# EasyEDA Pro project aixiaozhi.eprj

# Schematic Schematic1
Board Name: Board1; Create Date: 2025-05-02; Page Name: P1; Project Name: aixiaozhi; Schematic Name: Schematic1; Update Date: 2025-05-04; Company: 嘉立创EDA; Page Size: A4; Version: V1.0
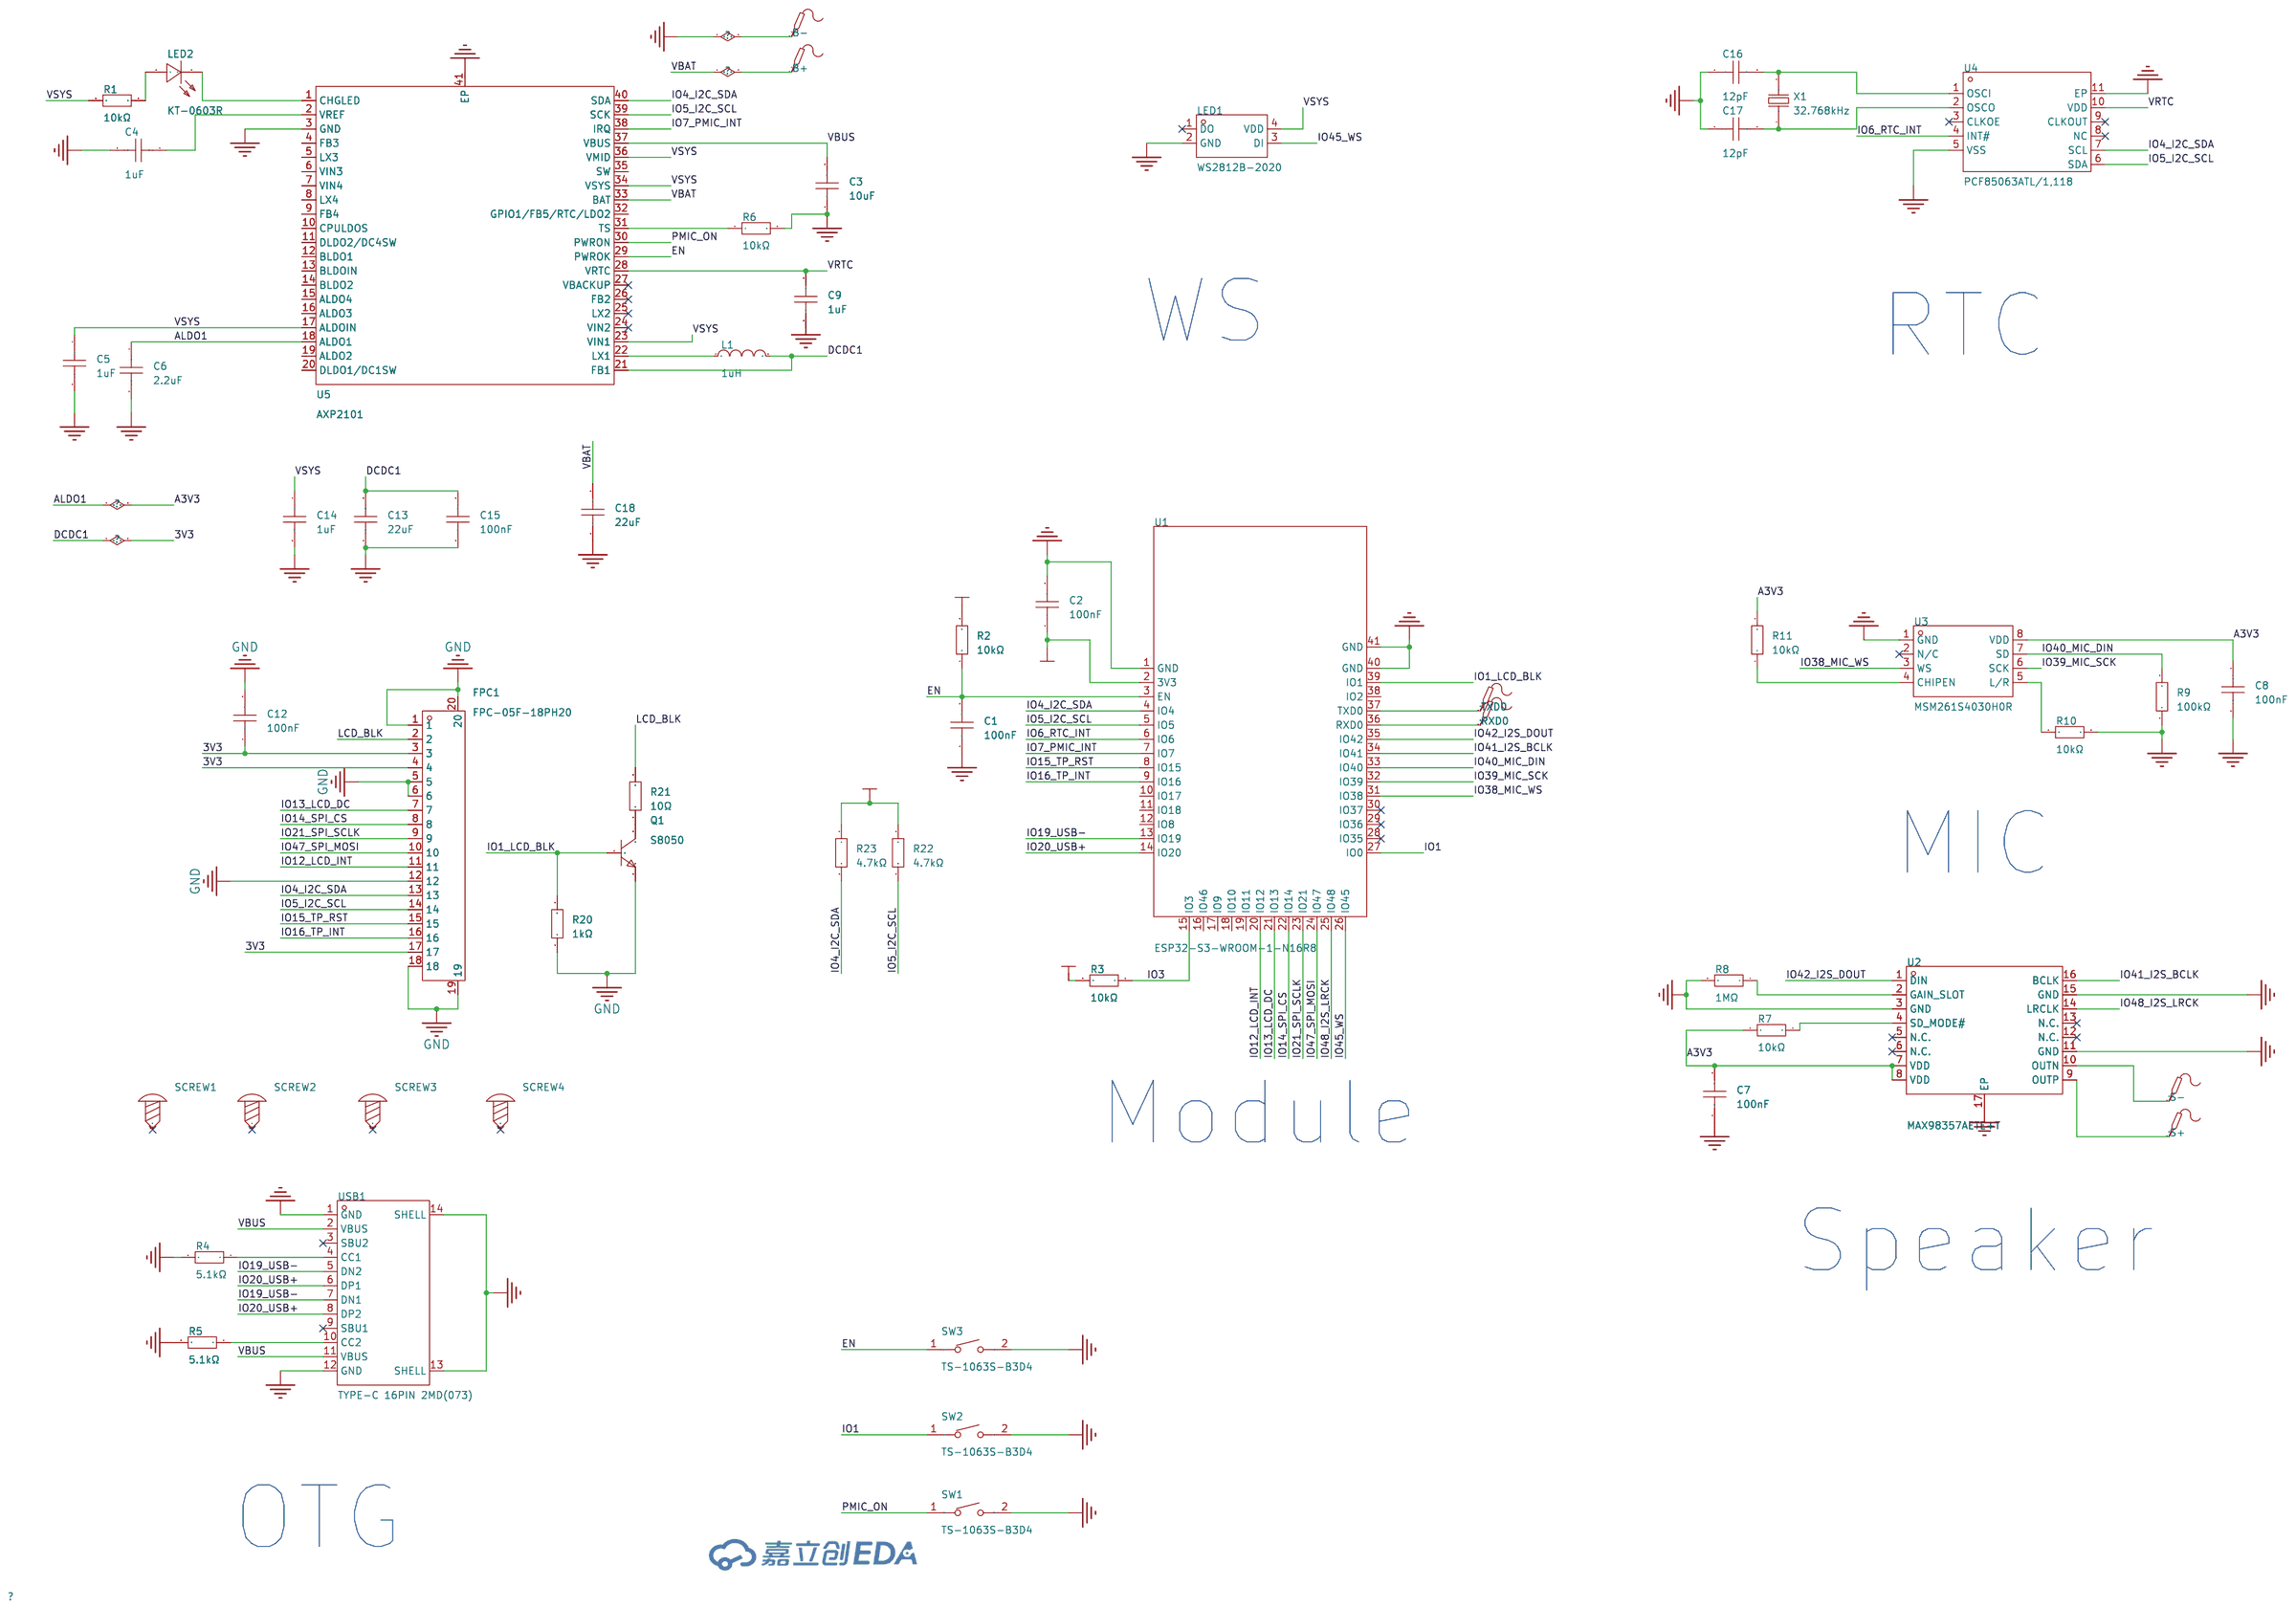
[diagram p0: schematic sheet]

## Parts
B+  -  [Test-Point-0.5mm]
B-  -  [Test-Point-0.5mm]
C1  100nF  [C0402]
C2  100nF  [C0402]
C3  10uF  [C0603]
C4  1uF  [C0402]
C5  1uF  [C0402]
C6  2.2uF  [C0402]
C7  100nF  [C0402]
C8  100nF  [C0402]
C9  1uF  [C0402]
C12  100nF  [C0402]
C13  22uF  [C0603]
C14  1uF  [C0402]
C15  100nF  [C0402]
C16  12pF  [C0402]
C17  12pF  [C0402]
C18  22uF  [C0603]
FPC1  FPC-05F-18PH20  [FPC-SMD_18P-P0.50_FPC-05F-18PH20]
L1  1uH  [IND-SMD_L4.4-W4.2]
LED1  WS2812B-2020  [LED-SMD_4P-L2.0-W2.0-TL_WS2812B-2020]
LED2  KT-0603R  [LED0603-RD]
Q1  S8050  [SOT-23-3_L2.9-W1.3-P1.90-LS2.3-BR]
R1  10kΩ  [R0402]
R2  10kΩ  [R0402]
R3  10kΩ  [R0402]
R4  5.1kΩ  [R0402]
R5  5.1kΩ  [R0402]
R6  10kΩ  [R0402]
R7  10kΩ  [R0402]
R8  1MΩ  [R0402]
R9  100kΩ  [R0402]
R10  10kΩ  [R0402]
R11  10kΩ  [R0402]
R20  1kΩ  [R0402]
R21  10Ω  [R0402]
R22  4.7kΩ  [R0402]
R23  4.7kΩ  [R0402]
RXD0  -  [Test-Point-0.5mm]
S+  -  [Test-Point-0.5mm]
S-  -  [Test-Point-0.5mm]
SCREW1  -  [M2螺丝]
SCREW2  -  [M2螺丝]
SCREW3  -  [M2螺丝]
SCREW4  -  [M2螺丝]
SW1  TS-1063S-B3D4  [KEY-SMD_L3.0-W2.5-LS4.0_TS-1603S]
SW2  TS-1063S-B3D4  [KEY-SMD_L3.0-W2.5-LS4.0_TS-1603S]
SW3  TS-1063S-B3D4  [KEY-SMD_L3.0-W2.5-LS4.0_TS-1603S]
TXD0  -  [Test-Point-0.5mm]
U1  ESP32-S3-WROOM-1-N16R8  [WIRELM-SMD_ESP32-S3-WROOM-1]
U2  MAX98357AETE+T  [TQFN-16_L3.0-W3.0-P0.50-BL-EP1.5]
U3  MSM261S4030H0R  [MIC-SMD_8P-L4.0-W3.0-P1.00-BR]
U4  PCF85063ATL/1,118  [DFN-10_L2.6-W2.6-P0.50-BL-EP]
U5  AXP2101  [QFN-40_L5.0-W5.0-P0.40-TL-EP3.4]
USB1  TYPE-C 16PIN 2MD(073)  [USB-C-SMD_TYPE-C-6PIN-2MD-073]
X1  32.768kHz  [FC-135R_L3.2-W1.5]

## Library data of the parts
B+ B- RXD0 S+ S- TXD0 = Test-Point
C1 C2 C4-C9 C12 C14-C17 = CL05A105KA5NQNC: LCSC Part Name: 1uF ±10% 25V; Supplier Part: C52923; Manufacturer: SAMSUNG(三星); Supplier Footprint: 0402; JLCPCB Part Class: 基础库; Datasheet: https://atta.szlcsc.com/upload/public/pdf/source/20160218/1457707763339.pdf; Supplier: LCSC; Tolerance: ±10%; Voltage Rated: 25V; Temperature Coefficient: X5R
C3 C13 C18 = CL10A226MQ8NRNC: LCSC Part Name: 22uF ±20% 6.3V; Supplier Part: C59461; Manufacturer: SAMSUNG(三星); Supplier Footprint: 0603; JLCPCB Part Class: 基础库; Datasheet: https://atta.szlcsc.com/upload/public/pdf/source/20160218/1457707763339.pdf; Supplier: LCSC; Tolerance: ±20%; Voltage Rated: 6.3V; Temperature Coefficient: X5R
FPC1 = FPC-05F-18PH20: LCSC Part Name: 间距:0.5mm P数:18P 翻盖式 下接; Supplier Part: C2856802; Manufacturer: XUNPU(讯普); Supplier Footprint: SMD,P=0.5mm,卧贴; JLCPCB Part Class: 扩展库; Datasheet: https://atta.szlcsc.com/upload/public/pdf/source/20210922/C2856802_2A845D1961F33AEC1ED22CECB292335F.pdf; Supplier: LCSC; Locking Feature: 翻盖式; Contact Type: 下接; Number of Contacts: 18P; Pitch: 0.5mm; Mounting Type: 卧贴; FFC, FCB Thickness: 0.3mm; Height Above Board: 2mm; Operating Temperature Range: -25℃~+85℃
L1 = FXL0420-2R2-M: LCSC Part Name: 2.2uH ±20% 5A; Supplier Part: C167206; Manufacturer: cjiang(长江微电); Supplier Footprint: SMD,4.2x4.4mm; JLCPCB Part Class: 扩展库; Datasheet: https://atta.szlcsc.com/upload/public/pdf/source/20240426/3189EA8206330E2108542F9E34E540E7.pdf; Supplier: LCSC; Tolerance: ±20%; Rated Current: 4.5A; Saturation Current (Isat): 5A; DC Resistance (DCR): 58mΩ; Type: 一体成型电感
LED1 = WS2812B-2020: LCSC Part Name: RGB三色; Supplier Part: C965555; Manufacturer: worldsemi; Supplier Footprint: SMD,2x2mm; JLCPCB Part Class: 扩展库; Datasheet: https://atta.szlcsc.com/upload/public/pdf/source/20241202/DEE3FC25B8AD87F3BB1718ACD77EDECD.pdf; Supplier: LCSC; Wavelength: 515.6nm；622.5nm；470.4nm
LED2 = KT-0603R: LCSC Part Name: 0603 红灯 高亮; Supplier Part: C2286; Manufacturer: KENTO; Supplier Footprint: 0603; JLCPCB Part Class: 基础库; Datasheet: https://atta.szlcsc.com/upload/public/pdf/source/20160616/1466072038404.pdf; Supplier: LCSC; Emitted Color: 红色; Operating Temperature: -40℃~+85℃
Q1 = S8050_C20069125: LCSC Part Name: hFE:200-350，丝印:J3Y S8050; Supplier Part: C20069125; Manufacturer: 宏嘉诚; Supplier Footprint: SOT-23; JLCPCB Part Class: 扩展库; Datasheet: https://atta.szlcsc.com/upload/public/pdf/source/20250107/343E8B94B5C24D0D65D7D4B70E0B73F6.pdf; Supplier: LCSC; type: NPN; Current - Collector(Ic): 500mA; Collector - Emitter Voltage VCEO: 25V; Pd - Power Dissipation: 300mW; DC Current Gain: 120@50mA,1.0V; Transition frequency(fT): 100MHz; Current - Collector Cutoff: 100nA; Vce Saturation(VCE(sat)): 600mV; Operating Temperature: -55℃~+150℃
R1-R11 R20-R23 = 0402WGF1002TCE: LCSC Part Name: 10kΩ ±1% 62.5mW 厚膜电阻; Supplier Part: C25744; Manufacturer: UNI-ROYAL(厚声); Supplier Footprint: 0402; Datasheet: https://atta.szlcsc.com/upload/public/pdf/source/20200306/C422600_1E6D84923E4A46A82E41ADD87F860B5C.pdf; Supplier: LCSC; Type: 厚膜电阻; Tolerance: ±1%; Power(Watts): 62.5mW; Overload Voltage (Max): 50V; Temperature Coefficient: ±100ppm/℃; Operating Temperature Range: -55℃~+155℃
SCREW1-SCREW4 = M2螺丝: Supplier Footprint: 插件
SW1-SW3 = TS-1063S-B3D4: LCSC Part Name: 轻触开关3.0*2.5侧按贴片带柱小小龟250gf; Supplier Part: C498291; Manufacturer: Yuandi(元迪); JLCPCB Part Class: 扩展库; Datasheet: https://atta.szlcsc.com/upload/public/pdf/source/20200318/C498291_A3607BD92317BA61A63F6AFAF35A0DD0.pdf; Supplier: LCSC; Circuit: 单刀单掷; Actuator Style: 矩形按钮; Operating Force: 250gf
U1 = ESP32-S3-WROOM-1-N16R8: LCSC Part Name: 通用型Wi-Fi+低功耗蓝牙MCU模组; Supplier Part: C2913202; Manufacturer: ESPRESSIF(乐鑫); Supplier Footprint: SMD,18x25.5mm; Datasheet: https://atta.szlcsc.com/upload/public/pdf/source/20220705/4E799F39581577F766659887F738A439.pdf; Supplier: LCSC
U2 = MAX98357AETE+T: LCSC Part Name: 微型、低成本、PCM 类 D 级放大器具有 AB 级性能; Supplier Part: C910544; Manufacturer: ADI(亚德诺)/MAXIM(美信); Supplier Footprint: TQFN-16-EP(3x3); Datasheet: https://atta.szlcsc.com/upload/public/pdf/source/20210106/C910544_CB6DE4B2CEE254A72E6BDB40E718D281.pdf; Supplier: LCSC; Speaker Channels: 单声道; Output Power: 3.2Wx2@4Ω; Supply Voltage: 2.5V~5.5V; Operating Temperature: -40℃~+85℃
U3 = MSM261S4030H0R: Supplier Part: C2840615; Manufacturer: MEMS(敏芯微); Datasheet: https://atta.szlcsc.com/upload/public/pdf/source/20210707/C2840615_6AE5BCBEE3224C96A8195D5DC270E7C8.pdf; Supplier: LCSC
U4 = PCF85063ATL/1,118: Supplier Part: C404360; Manufacturer: NXP(恩智浦); Supplier Footprint: DFN-10-EP(2.6x2.6); Datasheet: https://www.nxp.com.cn/docs/en/data-sheet/PCF85063A.pdf; Supplier: LCSC
U5 = AXP2101: Supplier Part: C3036461; Manufacturer: x-powers; Supplier Footprint: QFN-40-EP(5x5); Datasheet: https://atta.szlcsc.com/upload/public/pdf/source/20230506/27D868F447993329A9E953603DF31964.pdf; Supplier: LCSC
USB1 = TYPE-C 16PIN 2MD(073): LCSC Part Name: Type-C 母 卧贴; Supplier Part: C2765186; Manufacturer: SHOU HAN(首韩); Supplier Footprint: SMD; JLCPCB Part Class: 扩展库; Datasheet: https://atta.szlcsc.com/upload/public/pdf/source/20211123/39B17C16241EAC15C5E277BDA434118E.pdf; Supplier: LCSC; Connector Type: Type-C; Standard: USB 3.1; Gender: 母; Mounting Style: 卧贴; Number of Contacts: 16P; Number of Ports: 1; Current Rating - Power (Max): 5A; Operating Temperature Range: -25℃~+85℃; Rated Voltage (Max): 5V; Connect-Disconnect Life: 5千次; Core Colour: 黑色
X1 = Q13FC13500004_C32346: LCSC Part Name: 32.768kHz ±20ppm 12.5pF; Supplier Part: C32346; Manufacturer: EPSON(爱普生); Manufacturer Part: Q13FC13500004; Supplier Footprint: SMD3215-2P; Datasheet: https://atta.szlcsc.com/upload/public/pdf/source/20240418/0E0FF5F0356BA3753F616001439D1416.pdf; Supplier: LCSC; Crystal Type: 贴片晶振; Normal temperature Frequency Tolerance: ±20ppm; Load Capacitor: 12.5pF; Equivalent Series Resistance (ESR): 70kΩ; Operating Temperature: -40℃~+85℃

## Nets
3V3: C2.1 C12.1 C13.2 C15.2 FPC1.3 FPC1.4 FPC1.17 L1.2 R2.2 R3.2 R22.1 R23.1 U1.2(3V3) U5.21(FB1)
A3V3: C6.1 C7.2 C8.1 R7.2 R11.2 U2.7(VDD) U2.8(VDD) U3.8(VDD) U5.18(ALDO1)
GND: B-.1 C1.1 C2.2 C3.1 C4.2 C5.2 C6.2 C7.1 C8.2 C9.2 C12.2 C13.1 C14.2 C15.1 C16.1 C17.1 C18.1 FPC1.1 FPC1.5 FPC1.6 FPC1.12 FPC1.18 FPC1.19 FPC1.20 LED1.2(GND) Q1.2(E) R4.2 R5.2 R6.2 R8.2 R9.2 R10.2 R20.1 SW1.2 SW2.2 SW3.2 U1.1(GND) U1.40(GND) U1.41(GND) U2.3(GND) U2.11(GND) U2.15(GND) U2.17(EP) U3.1(GND) U4.5(VSS) U4.11(EP) U5.3(GND) U5.41(EP) USB1.1(GND) USB1.12(GND) USB1.13(SHELL) USB1.14(SHELL)
VBAT: B+.1 C18.2 U5.33(BAT)
VBUS: C3.2 U5.37(VBUS) USB1.2(VBUS) USB1.11(VBUS)
EN: C1.2 R2.1 SW3.1 U1.3(EN) U5.29(PWROK)
IO1: SW2.1 U1.27(IO0)
IO1_LCD_BLK: Q1.1(B) R20.2 U1.39(IO1)
IO3: R3.1 U1.15(IO3)
IO4_I2C_SDA: FPC1.13 R23.2 U1.4(IO4) U4.7(SCL) U5.40(SDA)
IO5_I2C_SCL: FPC1.14 R22.2 U1.5(IO5) U4.6(SDA) U5.39(SCK)
IO6_RTC_INT: U1.6(IO6) U4.4(INT#)
IO7_PMIC_INT: U1.7(IO7) U5.38(IRQ)
IO12_LCD_INT: FPC1.11 U1.20(IO12)
IO13_LCD_DC: FPC1.7 U1.21(IO13)
IO14_SPI_CS: FPC1.8 U1.22(IO14)
IO15_TP_RST: FPC1.15 U1.8(IO15)
IO16_TP_INT: FPC1.16 U1.9(IO16)
IO19_USB-: U1.13(IO19) USB1.5(DN2) USB1.7(DN1)
IO20_USB+: U1.14(IO20) USB1.6(DP1) USB1.8(DP2)
IO21_SPI_SCLK: FPC1.9 U1.23(IO21)
IO38_MIC_WS: U1.31(IO38) U3.3(WS)
IO39_MIC_SCK: U1.32(IO39) U3.6(SCK)
IO40_MIC_DIN: R9.1 U1.33(IO40) U3.7(SD)
IO41_I2S_BCLK: U1.34(IO41) U2.16(BCLK)
IO42_I2S_DOUT: U1.35(IO42) U2.1(DIN)
IO45_WS: LED1.3(DI) U1.26(IO45)
IO47_SPI_MOSI: FPC1.10 U1.24(IO47)
IO48_I2S_LRCK: U1.25(IO48) U2.14(LRCLK)
LCD_BLK: FPC1.2 R21.2
PMIC_ON: SW1.1 U5.30(PWRON)
VRTC: C9.1 U4.10(VDD) U5.28(VRTC)
VSYS: C5.1 C14.1 LED1.4(VDD) R1.1 U5.17(ALDOIN) U5.23(VIN1) U5.34(VSYS) U5.36(VMID)
$1N2950: C4.1 U5.2(VREF)
$1N3028: R6.1 U5.31(TS)
$1N3394: R7.1 U2.4(SD_MODE#)
$1N3465: R8.1 U2.2(GAIN_SLOT)
$1N3717: R10.1 U3.5(L/R)
$1N3891: R11.1 U3.4(CHIPEN)
$1N4104: C17.2 U4.2(OSCO) X1.1
$1N4110: C16.2 U4.1(OSCI) X1.2
$1N5969: Q1.3(C) R21.1
$1N6173: L1.1 U5.22(LX1)
$1N7877: S-.1 U2.10(OUTN)
$1N7898: S+.1 U2.9(OUTP)
$1N8116: TXD0.1 U1.37(TXD0)
$1N8137: RXD0.1 U1.36(RXD0)
Net-(LED2-1): LED2.1(K) U5.1(CHGLED)
Net-(LED2-2): LED2.2(A) R1.2
Net-(R4-1): R4.1 USB1.4(CC1)
Net-(R5-1): R5.1 USB1.10(CC2)

Not connected (* = marked no-connect by the designer): LED1 1(DO)*; SCREW1 1*; SCREW2 1*; SCREW3 1*; SCREW4 1*; U1 10(IO17) 11(IO18) 12(IO8) 16(IO46) 17(IO9) 18(IO10) 19(IO11) 28(IO35)* 29(IO36)* 30(IO37)* 38(IO2); U2 5(N.C.)* 6(N.C.)* 12(N.C.)* 13(N.C.)*; U3 2(N/C)*; U4 3(CLKOE)* 8(NC)* 9(CLKOUT)*; U5 4(FB3) 5(LX3) 6(VIN3) 7(VIN4) 8(LX4) 9(FB4) 10(CPULDOS) 11(DLDO2/DC4SW) 12(BLDO1) 13(BLDOIN) 14(BLDO2) 15(ALDO4) 16(ALDO3) 19(ALDO2) 20(DLDO1/DC1SW) 24(VIN2)* 25(LX2)* 26(FB2)* 27(VBACKUP)* 32(GPIO1/FB5/RTC/LDO2) 35(SW); USB1 3(SBU2)* 9(SBU1)*

## Notes on the sheet
- WS
- RTC
- MIC
- Module
- Speaker
- OTG

# Board PCB1
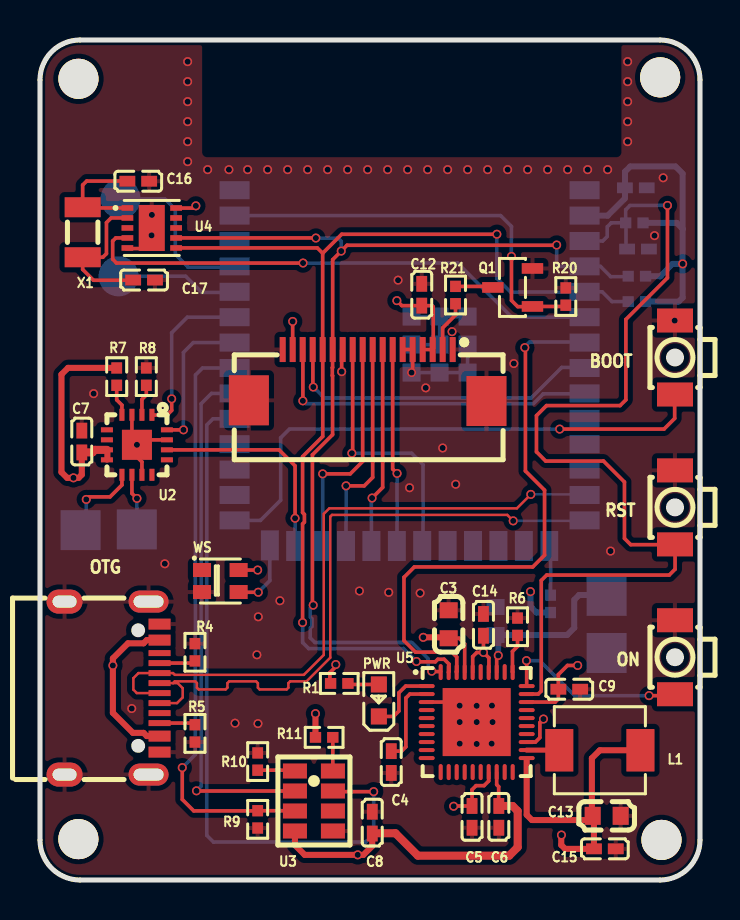
[diagram p1: board, top side]
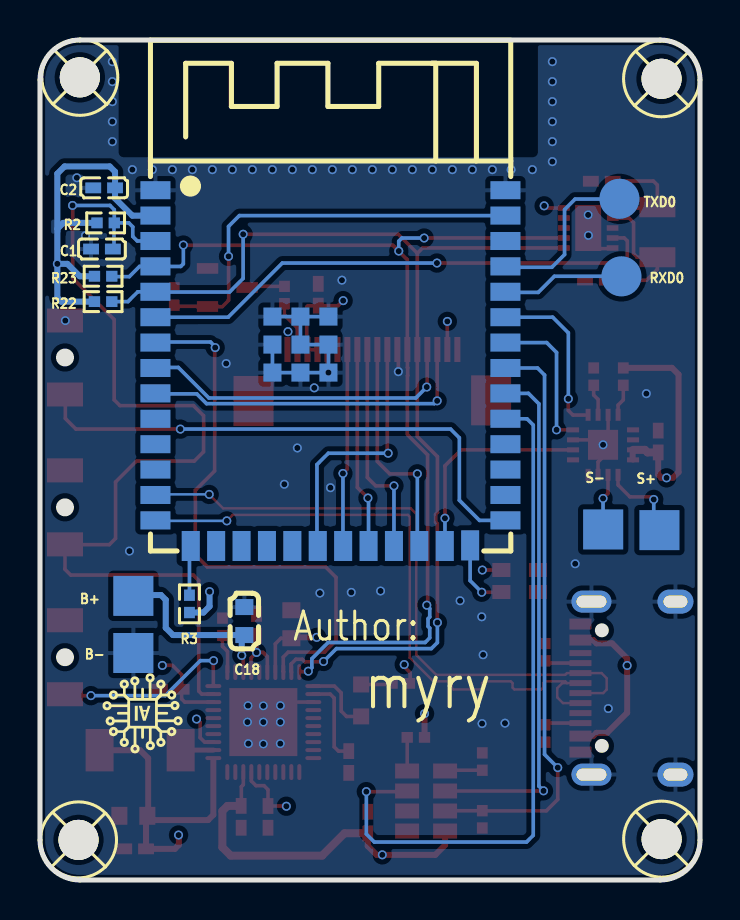
[diagram p2: board, bottom side, seen from below]

Outline 33 x 42 mm; copper layers: Top Layer, GND, PWR, Bottom Layer. Coordinates in mm from the lower left corner of the outline.
Outline path: 0,40 0,2 arc(0.59,0.59) 2,0 31,0 arc(32.41,0.59) 33,2 33,40 arc(32.41,41.41) 31,42 2,42 arc(0.59,41.41) 0,40
Stack: Top Layer 0.035mm 外层铜厚1oz / Dielectric1 0.2104mm 7628 RC49% 8.6mil / GND 0.0152mm 内层铜厚 / Dielectric2 1.065mm 1.1mm H/HOZ Copper / PWR 0.0152mm 内层铜厚 / Dielectric3 0.2104mm 7628 RC49% 8.6mil / Bottom Layer 0.035mm 外层铜厚1oz

## Design rules (mm)
net IO19_USB-: DP1
net IO20_USB+: DP1
template: 自定义配置
spacing copperThickness1oz (default): track to track 0.102, other pairs 0.152 to 0.3
spacing copperThickness2oz: track to track 0.203, other pairs 0.152 to 0.3
track width copperThickness1oz (default): min 0.127, default 0.18, max 2.54
track width copperThickness2oz: min 0.203, default 0.254, max 2.54
differential pair differentialPair (default): width min 0.124, default 0.124, max 2.54; gap min 0.203, default 0.203
via viaSize (default): diameter min 0.4, default 0.45, max 10; hole min 0.3, default 0.305, max 6.3

## Placement (name value [footprint] x y rotation side)
B+  -  [Test-Point-0.5mm#2]  28.33 14.21 180 bottom
B-  -  [Test-Point-0.5mm#2]  28.33 11.35 180 bottom
BOOT  TS-1063S-B3D4  [KEY-SMD_L3.0-W2.5-LS4.0_TS-1603S]  31.75 26.12 90 top
C1  100nF  [C0402]  29.9 31.55 180 bottom
C2  100nF  [C0402]  29.79 34.61 0 bottom
C3  10uF  [C0603]  20.43 12.79 270 top
C4  1uF  [C0402]  17.56 5.9 270 top
C5  1uF  [C0402]  21.6 3.16 270 top
C6  2.2uF  [C0402]  22.94 3.16 270 top
C7  100nF  [C0402]  2.09 21.92 270 top
C8  100nF  [C0402]  16.61 2.87 90 top
C9  1uF  [C0402]  26.46 9.54 0 top
C12  100nF  [C0402]  19.09 29.26 90 top
C13  22uF  [C0603]  28.33 3.21 180 top
C14  1uF  [C0402]  22.17 12.76 90 top
C15  100nF  [C0402]  28.24 1.56 180 top
C16  12pF  [C0402]  4.91 34.94 180 top
C17  12pF  [C0402]  5.2 30 180 top
C18  22uF  [C0603]  22.78 12.95 270 bottom
FPC1  FPC-05F-18PH20  [FPC-SMD_18P-P0.50_FPC-05F-18PH20]  16.38 25.24 0 top
L1  1uH  [IND-SMD_L4.4-W4.2]  27.99 6.49 180 top
ON  TS-1063S-B3D4  [KEY-SMD_L3.0-W2.5-LS4.0_TS-1603S]  31.75 11.14 90 top
OTG  TYPE-C 16PIN 2MD(073)  [USB-C-SMD_TYPE-C-6PIN-2MD-073]  3.6 9.6 270 top
PWR  KT-0603R  [LED0603-RD]  16.94 8.98 90 top
Q1  S8050  [SOT-23-3_L2.9-W1.3-P1.90-LS2.3-BR]  23.63 29.63 0 top
R1  10kΩ  [R0402]  14.96 9.83 0 top
R2  10kΩ  [R0402]  29.72 32.86 0 bottom
R3  10kΩ  [R0402]  25.53 13.81 270 bottom
R4  5.1kΩ  [R0402]  7.75 11.39 90 top
R5  5.1kΩ  [R0402]  7.75 7.33 270 top
R6  10kΩ  [R0402]  23.88 12.66 90 top
R7  10kΩ  [R0402]  3.84 25.17 90 top
R8  1MΩ  [R0402]  5.32 25.17 90 top
R9  100kΩ  [R0402]  10.88 3.03 270 top
R10  10kΩ  [R0402]  10.88 5.92 90 top
R11  10kΩ  [R0402]  14.21 7.13 180 top
R20  1kΩ  [R0402]  26.29 29.17 270 top
R21  10Ω  [R0402]  20.78 29.25 270 top
R22  4.7kΩ  [R0402]  29.84 28.92 180 bottom
R23  4.7kΩ  [R0402]  29.84 30.19 180 bottom
RST  TS-1063S-B3D4  [KEY-SMD_L3.0-W2.5-LS4.0_TS-1603S]  31.75 18.63 90 top
RXD0  -  [Test-Point-0.5mm]  3.93 30.18 180 bottom
S+  -  [Test-Point-0.5mm#2]  2.03 17.49 180 bottom
S-  -  [Test-Point-0.5mm#2]  4.84 17.53 180 bottom
SCREW1  -  [M2螺丝]  31.07 2.01 180 bottom
SCREW2  -  [M2螺丝]  1.92 2.04 180 bottom
SCREW3  -  [M2螺丝]  31.01 40.13 180 bottom
SCREW4  -  [M2螺丝]  1.92 40.06 180 bottom
TXD0  -  [Test-Point-0.5mm]  4.03 34.06 180 bottom
U1  ESP32-S3-WROOM-1-N16R8  [WIRELM-SMD_ESP32-S3-WROOM-1]  18.48 25.6 180 bottom
U2  MAX98357AETE+T  [TQFN-16_L3.0-W3.0-P0.50-BL-EP1.5]  4.85 21.76 180 top
U3  MSM261S4030H0R  [MIC-SMD_8P-L4.0-W3.0-P1.00-BR]  13.7 3.95 0 top
U4  PCF85063ATL/1,118  [DFN-10_L2.6-W2.6-P0.50-BL-EP]  5.59 32.6 270 top
U5  AXP2101  [QFN-40_L5.0-W5.0-P0.40-TL-EP3.4]  21.83 7.9 0 top
WS  WS2812B-2020  [LED-SMD_4P-L2.0-W2.0-TL_WS2812B-2020]  9.02 14.95 0 top
X1  32.768kHz  [FC-135R_L3.2-W1.5]  2.13 32.39 90 top

## Footprints (pads in the part's own frame, mm; a bottom-side part is the same pattern mirrored in y, then rotated)
C0402
  rect 0.79x0.54 smd: 1(-0.545,0) 2(0.545,0)
C0603
  rect 0.8x0.9 smd: 1(-0.7,0) 2(0.7,0)
DFN-10_L2.6-W2.6-P0.50-BL-EP
  rect 0.28x0.585 smd: 1(-1,-1.218) 2(-0.5,-1.218) 3(0,-1.218) 4(0.5,-1.218) 5(1,-1.218) 6(1,1.218) 7(0.5,1.218) 8(0,1.218) 9(-0.5,1.218) 10(-1,1.218)
  rect 2.3x1.3 smd: 11(0,0)
FC-135R_L3.2-W1.5
  rect 1x1.8 smd: 1(-1.25,0) 2(1.25,0)
FPC-SMD_18P-P0.50_FPC-05F-18PH20
  rect 0.3x1.25 smd: 1(4.25,1.288) 2(3.75,1.288) 3(3.25,1.288) 4(2.75,1.288) 5(2.25,1.288) 6(1.75,1.288) 7(1.25,1.288) 8(0.75,1.288) 9(0.25,1.288) 10(-0.25,1.288) 11(-0.75,1.288) 12(-1.25,1.288) 13(-1.75,1.288) 14(-2.25,1.288) 15(-2.75,1.288) 16(-3.25,1.288) 17(-3.75,1.288) 18(-4.25,1.288)
  rect 2x2.5 smd: 19(5.94,-1.288) 20(-5.94,-1.252)
IND-SMD_L4.4-W4.2
  rect 1.4x2.12 smd: 1(2.028,0) 2(-2.028,0)
KEY-SMD_L3.0-W2.5-LS4.0_TS-1603S
  rect 1.2x1.8 smd: 1(-1.85,0) 2(1.85,0)
LED0603-RD
  rect 0.8x0.8 smd: 1(-0.799,0) 2(0.799,0)
LED-SMD_4P-L2.0-W2.0-TL_WS2812B-2020
  rect 0.9x0.7 smd: 1(-0.915,0.55) 2(-0.915,-0.55) 3(0.915,-0.55) 4(0.915,0.55)
M2螺丝
  round 2 hole 2: 1(0,0)
MIC-SMD_8P-L4.0-W3.0-P1.00-BR
  rect 1.2x0.75 smd: 1(0.95,-1.5) 2(0.95,-0.5) 3(0.95,0.5) 4(0.95,1.5) 5(-0.95,1.5) 6(-0.95,0.5) 7(-0.95,-0.5) 8(-0.95,-1.5)
QFN-40_L5.0-W5.0-P0.40-TL-EP3.4
  oval 0.8x0.2 smd: 1(-2.5,1.8) 2(-2.5,1.4) 3(-2.5,1) 4(-2.5,0.6) 5(-2.5,0.2) 6(-2.5,-0.2) 7(-2.5,-0.6) 8(-2.5,-1) 9(-2.5,-1.4) 10(-2.5,-1.8) 21(2.5,-1.8) 22(2.5,-1.4) 23(2.5,-1) 24(2.5,-0.6) 25(2.5,-0.2) 26(2.5,0.2) 27(2.5,0.6) 28(2.5,1) 29(2.5,1.4) 30(2.5,1.8)
  oval 0.2x0.8 smd: 11(-1.8,-2.5) 12(-1.4,-2.5) 13(-1,-2.5) 14(-0.6,-2.5) 15(-0.2,-2.5) 16(0.2,-2.5) 17(0.6,-2.5) 18(1,-2.5) 19(1.4,-2.5) 20(1.8,-2.5) 31(1.8,2.5) 32(1.4,2.5) 33(1,2.5) 34(0.6,2.5) 35(0.2,2.5) 36(-0.2,2.5) 37(-0.6,2.5) 38(-1,2.5) 39(-1.4,2.5) 40(-1.8,2.5)
  rect 3.4x3.4 smd: 41(0,0)
R0402
  rect 0.566x0.54 smd: 1(-0.433,0) 2(0.433,0)
SOT-23-3_L2.9-W1.3-P1.90-LS2.3-BR
  rect 1.07x0.532 smd: 1(0.99,-0.95) 2(0.99,0.95) 3(-0.99,0)
Test-Point-0.5mm
  round 2 smd: 1(0,0)
Test-Point-0.5mm#2
  rect 2x2 smd: 1(0,0)
TQFN-16_L3.0-W3.0-P0.50-BL-EP1.5
  rect 0.25x0.6 smd: 1(-0.749,-1.5) 2(-0.248,-1.5) 3(0.252,-1.5) 4(0.751,-1.5) 9(0.75,1.5) 10(0.25,1.5) 11(-0.25,1.5) 12(-0.749,1.5)
  rect 0.6x0.25 smd: 5(1.5,-0.748) 6(1.5,-0.248) 7(1.5,0.252) 8(1.5,0.752) 13(-1.5,0.752) 14(-1.5,0.252) 15(-1.5,-0.248) 16(-1.5,-0.748)
  rect 1.5x1.5 smd: 17(0,0)
USB-C-SMD_TYPE-C-6PIN-2MD-073
  rect 0.55x1.1 smd: 1(-3.2,2.375) 2(-2.4,2.375) 11(2.4,2.375) 12(3.2,2.375)
  rect 0.3x1.1 smd: 3(-1.75,2.375) 4(-1.25,2.375) 5(-0.75,2.375) 6(-0.25,2.375) 7(0.25,2.375) 8(0.75,2.375) 9(1.25,2.375) 10(1.75,2.375)
  oval 1.1x2 hole 0.6x1.5: 13(-4.325,1.825) 14(4.325,1.825)
  oval 1.2x1.8 hole 0.6x1.2: 13(-4.325,-2.375) 14(4.325,-2.375)
WIRELM-SMD_ESP32-S3-WROOM-1
  rect 1.5x0.9 smd: 1(-8.75,8.895) 2(-8.75,7.625) 3(-8.75,6.355) 4(-8.75,5.085) 5(-8.75,3.815) 6(-8.75,2.545) 7(-8.75,1.275) 8(-8.75,0.005) 9(-8.75,-1.265) 10(-8.75,-2.535) 11(-8.75,-3.805) 12(-8.75,-5.075) 13(-8.75,-6.345) 14(-8.75,-7.615) 27(8.75,-7.615) 28(8.75,-6.345) 29(8.75,-5.075) 30(8.75,-3.805) 31(8.75,-2.535) 32(8.75,-1.265) 33(8.75,0.005) 34(8.75,1.275) 35(8.75,2.545) 36(8.75,3.815) 37(8.75,5.085) 38(8.75,6.355) 39(8.75,7.625) 40(8.75,8.895)
  rect 0.9x1.5 smd: 15(-6.985,-8.895) 16(-5.715,-8.895) 17(-4.445,-8.895) 18(-3.175,-8.895) 19(-1.905,-8.895) 20(-0.635,-8.895) 21(0.635,-8.895) 22(1.905,-8.895) 23(3.175,-8.895) 24(4.445,-8.895) 25(5.715,-8.895) 26(6.985,-8.865)
  rect 0.9x0.9 smd: 41(-2.9,-0.225) 41(-2.9,1.175) 41(-2.9,2.575) 41(-1.5,-0.225) 41(-1.5,1.175) 41(-1.5,2.575) 41(-0.1,-0.225) 41(-0.1,1.175) 41(-0.1,2.575)

## Nets
3V3: C2.1 C12.1 C13.2 C15.2 FPC1.3 FPC1.4 FPC1.17 L1.2 R2.2 R3.2 R22.1 R23.1 U1.2 U5.21
A3V3: C6.1 C7.2 C8.1 R7.2 R11.2 U2.7 U2.8 U3.8 U5.18
GND: B-.1 BOOT.2 C1.1 C2.2 C3.1 C4.2 C5.2 C6.2 C7.1 C8.2 C9.2 C12.2 C13.1 C14.2 C15.1 C16.1 C17.1 C18.1 FPC1.1 FPC1.5 FPC1.6 FPC1.12 FPC1.18 FPC1.19 FPC1.20 ON.2 OTG.1 OTG.12 OTG.13 OTG.14 Q1.2 R4.2 R5.2 R6.2 R8.2 R9.2 R10.2 R20.1 RST.2 U1.1 U1.40 U1.41 U2.3 U2.11 U2.15 U2.17 U3.1 U4.5 U4.11 U5.3 U5.41 WS.2
VBAT: B+.1 C18.2 U5.33
VBUS: C3.2 OTG.2 OTG.11 U5.37
EN: C1.2 R2.1 RST.1 U1.3 U5.29
IO1: BOOT.1 U1.27
IO1_LCD_BLK: Q1.1 R20.2 U1.39
IO3: R3.1 U1.15
IO4_I2C_SDA: FPC1.13 R23.2 U1.4 U4.7 U5.40
IO5_I2C_SCL: FPC1.14 R22.2 U1.5 U4.6 U5.39
IO6_RTC_INT: U1.6 U4.4
IO7_PMIC_INT: U1.7 U5.38
IO12_LCD_INT: FPC1.11 U1.20
IO13_LCD_DC: FPC1.7 U1.21
IO14_SPI_CS: FPC1.8 U1.22
IO15_TP_RST: FPC1.15 U1.8
IO16_TP_INT: FPC1.16 U1.9
IO19_USB-: OTG.5 OTG.7 U1.13
IO20_USB+: OTG.6 OTG.8 U1.14
IO21_SPI_SCLK: FPC1.9 U1.23
IO38_MIC_WS: U1.31 U3.3
IO39_MIC_SCK: U1.32 U3.6
IO40_MIC_DIN: R9.1 U1.33 U3.7
IO41_I2S_BCLK: U1.34 U2.16
IO42_I2S_DOUT: U1.35 U2.1
IO45_WS: U1.26 WS.3
IO47_SPI_MOSI: FPC1.10 U1.24
IO48_I2S_LRCK: U1.25 U2.14
LCD_BLK: FPC1.2 R21.2
PMIC_ON: ON.1 U5.30
VRTC: C9.1 U4.10 U5.28
VSYS: C5.1 C14.1 R1.1 U5.17 U5.23 U5.34 U5.36 WS.4
$1N1442: PWR.1 U5.1
$1N1563: PWR.2 R1.2
$1N2082: OTG.4 R4.1
$1N2121: OTG.10 R5.1
$1N2950: C4.1 U5.2
$1N3028: R6.1 U5.31
$1N3394: R7.1 U2.4
$1N3465: R8.1 U2.2
$1N3717: R10.1 U3.5
$1N3891: R11.1 U3.4
$1N4104: C17.2 U4.2 X1.1
$1N4110: C16.2 U4.1 X1.2
$1N5969: Q1.3 R21.1
$1N6173: L1.1 U5.22
$1N7877: S-.1 U2.10
$1N7898: S+.1 U2.9
$1N8116: TXD0.1 U1.37
$1N8137: RXD0.1 U1.36

Pads without a net: OTG 3 9; SCREW1 1; SCREW2 1; SCREW3 1; SCREW4 1; U1 10 11 12 16 17 18 19 28 29 30 38; U2 5 6 12 13; U3 2; U4 3 8 9; U5 4 5 6 7 8 9 10 11 12 13 14 15 16 19 20 24 25 26 27 32 35; WS 1

## Via types
v1: diameter 0.45, hole 0.305, Top Layer to Bottom Layer, 119 vias

## Routing (per net, layer and track width the routed paths; a pad name or vN(x,y) marks a point on that pad's centre or on a via; arc(x,y) is an arc through that point)
3V3: length 115.9
  Top Layer w0.18: FPC1.17 v1(12.63,27.93) ; v1(17.84,28.97) 18.09,28.72 C12.1 19.6,28.72 19.66,28.66 19.66,26.55 FPC1.3 FPC1.4
  Top Layer w0.3: 24.33,5.98 24.33,3.26 24.59,3 27.56,3 27.63,3.07 C13.2 ; C13.2 27.7,3.14 27.7,1.56 26.25,1.56 26.06,1.75 26.06,2.24 v1(26.07,2.25) ; C13.2 27.59,3.25 27.59,6.09 27.99,6.49 L1.2
  PWR w0.3: v1(32.13,30.81) 30.05,30.81 29.25,30.01 29.25,2.62 28.81,2.18 26.14,2.18 v1(26.07,2.25) 26.07,13.61 25.26,14.42 v1(24.52,14.42) 22.6,16.34 22.6,28.61 22.24,28.97 v1(17.84,28.97) 17.83,28.96 17.83,28.27 17.49,27.93 v1(12.63,27.93)
  Bottom Layer w0.3: 32.13,32.56 32.13,35.32 31.77,35.68 29.51,35.68 29.25,35.41 C2.1 29.25,34.08 28.38,33.22 27.23,33.22 U1.2 ; 32.13,32.56 31.84,32.86 R2.2 ; 32.13,32.56 v1(32.13,30.81) ; v1(32.13,30.81) 32.13,29.12 31.93,28.92 30.28,28.92 ; v1(32.13,30.81) 31.63,30.81 31.01,30.19 30.28,30.19 ; R3.2 24.83,13.37 24.52,13.68 v1(24.52,14.42)
A3V3: length 71.3
  Top Layer w0.18: U5.18 22.83,4.77 22.93,4.67 22.93,3.71 C6.1
  Top Layer w0.3: R7.2 3.83,25.61 1.4,25.61 1.07,25.28 1.07,20.39 1.36,20.11 v1(1.67,20.11) 1.93,20.11 2.09,20.27 C7.2 ; v1(13.77,8.32) R11.2 ; U3.8 12.75,1.74 13.23,1.26 v1(15.89,1.26) 16.17,1.26 16.61,1.7 C8.1 ; 3.35,21.02 3.37,21.04 3.37,21.5
  Top Layer w0.4: C8.1 16.63,2.34 17.77,2.34 18.89,1.22 23.46,1.22 23.88,1.64 23.88,3.45 23.63,3.7 C6.1 ; U2.7 2.75,21.51 2.62,21.38 C7.2
  PWR w0.3: v1(13.77,8.32) 15.41,8.32 15.89,7.85 v1(15.89,1.26) 4.72,1.26 2.73,3.24 2.73,17.09 1.67,18.15 v1(1.67,20.11)
GND: length 22
  Top Layer w0.18: U5.3 20.81,8.9 v1(20.98,8.72) ; 5.61,31.95 5.23,31.57 4.31,31.57 ; U2.11 5.1,20.9 4.85,21.15 v1(4.85,21.76) ; v1(15.08,25.42) 15.08,26.47 FPC1.12 ; v1(4.85,21.76) 5.09,22.01 U2.15 ; v1(4.85,21.76) 4.6,22.01 U2.3 ; v1(18.58,25.37) 18.63,25.43 FPC1.5 FPC1.6
  Bottom Layer w0.18: U1.41 U1.41 ; U1.41 U1.41 U1.41 v1(18.58,25.37) U1.41 U1.41 U1.41 ; U1.41 U1.41
  vias: v1(2.68,24.32) v1(4.59,8.57) v1(5.59,33.26) v1(5.58,32.23) v1(6.24,15.81) v1(7.38,40.92) v1(7.38,39.92) v1(7.38,38.92) v1(7.38,37.92) v1(7.38,36.92) v1(7.38,35.92) v1(8.38,35.52) v1(9.45,35.52) v1(9.75,7.84) v1(10.38,35.52) v1(10.91,13.16) v1(10.84,11.26) v1(10.9,7.82) v1(11.38,35.52) v1(12,13.96) v1(12.38,35.52) v1(13.38,35.52) v1(14.38,35.52) v1(15.38,35.52) v1(15.97,14.45) v1(16.38,35.52) v1(17.38,35.52) v1(17.44,14.38) v1(17.9,29.99) v1(18.38,35.52) v1(18.48,19.61) v1(19.01,14.35) v1(19.29,24.61) v1(19.38,35.52) v1(20.13,21.6) v1(20.38,35.52) v1(20.6,27.42) v1(20.78,19.79) v1(20.99,7.9) v1(20.99,6.82) v1(21.38,35.52) v1(21.83,8.71) v1(21.83,7.9) v1(21.83,6.8) v1(22.38,35.52) v1(22.6,8.72) v1(22.63,7.9) v1(22.58,6.82) v1(23.38,35.52) v1(23.69,25.82) v1(24.38,35.52) v1(25.38,35.52) v1(26.38,35.52) v1(27.38,35.52) v1(28.38,35.52) v1(28.53,16.45) v1(29.38,40.92) v1(29.38,39.92) v1(29.38,38.92) v1(29.38,37.92) v1(29.38,36.92) v1(30.73,32.22) v1(31.16,35.11) v1(31.73,27.97)
VBAT: length 9.2
  Top Layer w0.18: U5.33 22.83,11.15 v1(22.91,11.23)
  Bottom Layer w0.3: B+.1 28.29,14.25 26.95,14.25 26.71,14.01 26.71,12.61 26.35,12.25 C18.2 22.91,12.12 v1(22.91,11.23)
VBUS: length 28
  Top Layer w0.18: U5.37 21.23,11.81 20.95,12.09 C3.2
  Top Layer w0.3: v1(19.16,12.13) 20.39,12.13 C3.2 ; OTG.11 5.34,7.2 5.18,7.36 4.64,7.36 3.64,8.36 v1(3.64,10.73) 3.64,11.08 4.4,11.83 5.18,11.83 5.34,12 OTG.2
  PWR w0.3: v1(3.64,10.73) 3.65,10.72 4.52,10.72 5.94,12.13 v1(19.16,12.13)
EN: length 49.1
  Top Layer w0.18: v1(31.37,33.73) 31.37,30.11 29.29,28.03 29.29,24.01 29.01,23.72 25.33,23.72 24.82,23.22 24.82,21.41 25.28,20.95 28.17,20.95 29.22,19.9 29.22,17.08 29.53,16.77 31.74,16.77 RST.1 31.75,16.78 31.75,15.54 31.46,15.25 25.33,15.25 25.06,14.98 25.06,9.45 24.91,9.3 U5.29
  Bottom Layer w0.18: R2.1 29.3,32.84 29.3,31.46 ; R2.1 29.28,33.51 29.5,33.73 v1(31.37,33.73) ; R2.1 29.28,32.86 28.56,32.86 28.36,32.66 28.36,32.18 28.14,31.95 U1.3
IO1: length 27.1
  Top Layer w0.18: v1(25.98,22.55) 31.2,22.55 31.73,23.08 31.73,24.26 BOOT.1
  Bottom Layer w0.18: v1(25.98,22.55) 12.47,22.55 12.03,22.11 12.03,18.99 11.03,17.98 U1.27
IO1_LCD_BLK: length 20.6
  Top Layer w0.18: R20.2 26.23,28.68 Q1.1 24.61,28.67 23.88,28.67 23.57,28.98 v1(23.57,31.18)
  Bottom Layer w0.18: U1.39 23.03,33.22 23.57,32.68 v1(23.57,31.18)
IO3: length 2.5
  Bottom Layer w0.18: 25.53,14.24 25.53,16.64 U1.15
IO4_I2C_SDA: length 52.1
  Top Layer w0.18: v1(13.79,32.1) 13.79,32.1 U4.7 ; 19.54,10.43 19.56,10.42 20.04,10.42 ; FPC1.13 14.63,31.02 v1(15.06,31.45) 15.35,31.74 25.82,31.74 v1(25.83,31.75) ; 13.62,13.75 13.62,21.26 14.63,22.27 14.63,25.21 14.62,25.22 14.62,25.61 14.63,25.62 14.63,26.51
  Bottom Layer w0.18: 13.67,13.72 13.51,13.57 13.51,13.15 13.6,13.07 13.6,12.68 13.51,12.6 13.51,12.11 13.75,11.88 18.6,11.88 19.41,11.06 19.41,10.62 v1(19.59,10.44) ; v1(13.79,32.1) 14.9,32.1 15.06,31.94 15.06,31.45 ; R23.2 29.39,30.17 28.53,30.17 28.02,30.68 U1.4 27.23,30.68 25.96,30.68 25.83,30.81 v1(25.83,31.75)
  vias: v1(13.66,13.74)
IO5_I2C_SCL: length 54.3
  Top Layer w0.18: 14.13,31.34 15.08,32.29 v1(22.84,32.29) ; 14.13,31.34 FPC1.14 ; 14.13,31.34 13.87,31.6 U4.6 ; v1(13.13,12.87) 13.13,17.8 13.22,17.89 13.22,18.28 13.13,18.37 13.13,21.17 14.14,22.18 14.14,26.5 ; 20.42,10.39 20.45,10.42 20.45,10.8 20.21,11.04 19.89,11.04 19.76,10.91 18.84,10.91
  Bottom Layer w0.18: v1(18.82,10.93) 18.18,11.57 13.43,11.57 13.13,11.87 13.13,12.86 ; 27.48,29.41 27.46,29.4 23.52,29.4 22.84,30.08 v1(22.84,32.29) ; 27.48,29.41 U1.5 ; 27.48,29.41 28.11,29.41 28.6,28.92 R22.2
IO6_RTC_INT: length 26.5
  Top Layer w0.18: U4.4 3.79,32.1 3.63,31.95 3.63,31.04 3.82,30.85 v1(13.15,30.85)
  Bottom Layer w0.18: v1(13.15,30.85) 20.88,30.85 23.59,28.14 U1.6
IO7_PMIC_INT: length 28.2
  Top Layer w0.18: 20.82,10.38 20.82,10.42 20.84,10.44 20.84,11.15 20.59,11.39 18.78,11.39 18.2,11.97 18.2,15.14 18.72,15.65 24.63,15.65 25.23,16.25 25.23,19.49 24.27,20.45 24.27,26.57 24.26,26.57
  Bottom Layer w0.18: 24.22,26.64 24.47,26.9 27.22,26.9
  vias: v1(24.24,26.62)
IO12_LCD_INT: length 13.1
  Top Layer w0.18: FPC1.11 15.63,21.38 v1(15.59,21.34)
  Bottom Layer w0.18: U1.20 19.15,16.74 19.15,20.77 18.58,21.34 v1(15.59,21.34)
IO13_LCD_DC: length 9.9
  Top Layer w0.18: FPC1.7 17.63,20.55 v1(17.85,20.33)
  Bottom Layer w0.18: U1.21 17.85,16.71 v1(17.85,20.33)
IO14_SPI_CS: length 10.1
  Top Layer w0.18: v1(16.6,19.1) 17.13,19.63 FPC1.8
  Bottom Layer w0.18: U1.22 16.57,19.07 v1(16.6,19.1)
IO15_TP_RST: length 16.4
  Top Layer w0.18: v1(13.66,24.65) 13.64,24.63 13.64,26.51 FPC1.15
  Bottom Layer w0.18: U1.8 27.2,25.63 26.08,25.63 24.56,24.1 14.21,24.1 v1(13.66,24.65)
IO16_TP_INT: length 16.9
  Top Layer w0.18: v1(13.14,23.96) 13.14,26.51 FPC1.16
  Bottom Layer w0.18: U1.9 27.21,24.31 25.16,24.31 24.67,23.82 13.28,23.82 v1(13.14,23.96)
IO19_USB-: length 32.5
  Top Layer w0.124: OTG.7 4.84,9.35 4.67,9.52 4.67,10.09 4.92,10.35 OTG.5 6.65,10.35 6.74,10.26 13.19,10.26 14.19,11.25 14.19,18.3 14.47,18.58 23.84,18.58 v1(24.54,19.28)
  Bottom Layer w0.124: U1.13 27.2,19.28 v1(24.54,19.28)
IO20_USB+: length 32.5
  Top Layer w0.124: OTG.6 6.65,9.85 ; 6.65,9.85 6.74,9.93 7.76,9.93 7.85,9.84 7.85,9.62 7.93,9.53 9.28,9.53 9.37,9.62 9.37,9.84 9.46,9.93 10.81,9.93 10.89,9.84 10.89,9.62 10.98,9.53 12.33,9.53 12.42,9.62 12.42,9.84 12.51,9.93 13.33,9.93 14.51,11.12 14.51,18.17 14.6,18.26 23.36,18.26 v1(23.66,17.96) ; 6.65,9.85 6.88,9.85 7.14,9.59 7.14,9.13 6.85,8.85 OTG.8
  Bottom Layer w0.124: v1(23.66,17.96) 27.2,17.96 U1.14
IO21_SPI_SCLK: length 10.9
  Top Layer w0.18: v1(15.3,19.71) 16.21,19.71 16.63,20.13 FPC1.9
  Bottom Layer w0.18: v1(15.3,19.71) U1.23
IO38_MIC_WS: length 34.9
  Top Layer w0.18: v1(16.68,4.42) 14.68,4.42 U3.3
  Bottom Layer w0.18: U1.31 8.65,23.06 8.34,22.75 8.34,2.23 8.67,1.9 16.28,1.9 16.68,2.3 v1(16.68,4.42)
IO39_MIC_SCK: length 26.3
  Top Layer w0.18: v1(7.82,4.46) 7.83,4.45 U3.6
  Bottom Layer w0.18: v1(7.82,4.46) 8.06,4.69 8.06,23.81 8.58,24.33 U1.32
IO40_MIC_DIN: length 29.5
  Top Layer w0.18: U3.7 12.73,3.46 R9.1 10.88,3.46 7.68,3.46 7.11,4.03 v1(7.11,5.62)
  Bottom Layer w0.18: v1(7.11,5.62) 7.77,6.28 7.77,25.25 8.13,25.6 U1.33
IO41_I2S_BCLK: length 7.5
  Top Layer w0.18: v1(7.17,22.51) U2.16
  Bottom Layer w0.18: U1.34 7.67,26.87 7.17,26.38 v1(7.17,22.51)
IO42_I2S_DOUT: length 8.4
  Top Layer w0.18: U2.1 5.61,23.25 6.35,23.25 6.58,23.48 v1(6.58,24.06)
  Bottom Layer w0.18: v1(6.58,24.06) 6.58,27.36 7.37,28.14 U1.35
IO45_WS: length 3.6
  Top Layer w0.18: 9.93,14.4 9.94,14.39 v1(10.91,14.39)
  Bottom Layer w0.18: U1.26 11.49,14.97 v1(10.91,14.39)
IO47_SPI_MOSI: length 11.5
  Top Layer w0.18: v1(14.13,20.31) 15.51,20.31 16.13,20.93 FPC1.10
  Bottom Layer w0.18: U1.24 14.13,16.8 v1(14.13,20.31)
IO48_I2S_LRCK: length 10.5
  Top Layer w0.18: v1(12.75,18.09) 12.75,20.71 11.95,21.51 6.63,21.51
  Bottom Layer w0.18: U1.25 12.75,16.71 v1(12.75,18.09)
LCD_BLK: length 2.6
  Top Layer w0.18: 20.78,28.82 20.78,28.25 20.13,27.61 FPC1.2
PMIC_ON: length 9.5
  Top Layer w0.18: v1(30.45,9.22) 31.68,9.22 ON.1 ; U5.30 24.33,10.96 v1(24.32,10.97)
  Bottom Layer w0.18: v1(30.45,9.22) 26.73,9.22 24.98,10.97 v1(24.32,10.97)
VRTC: length 45.6
  Top Layer w0.18: U5.28 25.76,8.9 25.92,9.05 C9.1 25.92,10.27 26.37,10.73 v1(26.88,10.73) ; U4.10 6.81,33.6 7.68,33.6 v1(7.79,33.71)
  PWR w0.18: v1(7.79,33.71) 24.2,33.71 25.06,32.85 25.06,22.2 26.88,20.38 v1(26.88,10.73)
VSYS: length 48.7
  Top Layer w0.18: R1.1 14.49,9.87 14.49,10.37 14.79,10.66 v1(14.79,10.77) ; U5.23 24.77,6.9 24.99,7.12 24.99,7.87 v1(25.17,8.05) ; U5.17 22.43,4.95 22.2,4.72 21.8,4.72 21.6,4.52 C5.1 20.7,3.7 v1(20.68,3.69) ; U5.34 22.45,10.41 22.45,11.11 v1(22.17,11.38) ; v1(22.17,11.38) C14.1 ; v1(22.17,11.38) 21.84,11.38 21.63,11.17 U5.36 ; v1(10.88,15.5) 9.93,15.5
  PWR w0.18: 22.17,11.71 22.17,15.03 21.7,15.5 v1(10.88,15.5) ; 22.17,11.71 v1(22.17,11.38) 21.92,11.64 15.43,11.64 14.79,11 v1(14.79,10.77) ; 22.17,11.71 22.39,11.93 24.58,11.93 25.17,11.34 v1(25.17,8.05) 25.21,8.01 25.21,4.12 24.78,3.69 v1(20.68,3.69)
$1N1442: length 3.6
  Top Layer w0.18: PWR.1 17.67,8.18 17.94,8.45 17.94,9.36 18.28,9.7 U5.1
$1N1563: length 1.6
  Top Layer w0.18: 15.4,9.86 15.48,9.78 PWR.2
$1N2082: length 1.8
  Top Layer w0.18: OTG.4 7.64,10.85 R4.1
$1N2121: length 1.8
  Top Layer w0.18: OTG.10 7.66,7.85 R5.1
$1N2950: length 4.4
  Top Layer w0.18: U5.2 18.49,9.3 18.29,9.1 18.29,6.66 18.08,6.44 C4.1
$1N3028: length 1.9
  Top Layer w0.18: U5.31 23.62,10.41 23.62,11.43 23.88,11.68 R6.1
$1N3394: length 1.6
  Top Layer w0.18: R7.1 3.84,24.01 4.1,23.75 U2.4
$1N3465: length 1.6
  Top Layer w0.18: U2.2 5.1,24.03 5.32,24.25 R8.1
$1N3717: length 1.9
  Top Layer w0.18: U3.5 12.71,5.49 10.88,5.49
$1N3891: length 1.7
  Top Layer w0.18: R11.1 14.64,5.46 U3.4
$1N4104: length 7.3
  Top Layer w0.18: C17.2 4.65,29.99 2.67,29.99 2.13,30.53 X1.1 3.14,31.14 3.32,31.32 3.32,32.87 3.56,33.1 U4.2
$1N4110: length 5.7
  Top Layer w0.18: U4.1 2.17,33.6 X1.2 2.13,34.75 2.33,34.95 4.36,34.95 C16.2
$1N5969: length 1.9
  Top Layer w0.18: R21.1 22.59,29.68 Q1.3
$1N6173: length 1.6
  Top Layer w0.25: L1.1 25.96,6.5 U5.22
$1N7877: length 2.8
  Top Layer w0.18: v1(4.85,19.08) 4.6,19.33 U2.10
  Bottom Layer w0.18: S-.1 4.85,17.53 v1(4.85,19.08)
$1N7898: length 4.2
  Top Layer w0.18: v1(2.31,19.03) 2.44,19.16 3.5,19.16 4.1,19.75 U2.9
  Bottom Layer w0.18: S+.1 2.31,17.78 v1(2.31,19.03)
$1N8116: length 8.6
  Bottom Layer w0.18: 3.94,33.88 4.11,34.05 6.25,34.05 6.77,33.52 6.77,31.27 7.41,30.64 9.73,30.64
$1N8137: length 6.2
  Bottom Layer w0.18: 9.79,29.38 8.09,29.38 7.28,30.19 3.9,30.19

## Copper pours and planes (outline as drawn; the poured copper is in the pictures)
GND on Top Layer: -5.95,44.43 37.35,44.43 37.35,-1.27 -5.95,-1.27
GND on Bottom Layer: -7.08,43.75 36.22,43.75 36.22,-1.95 -7.08,-1.95
GND on GND: -4.49,46.45 38.81,46.45 38.81,-2.42 -4.49,-2.42
GND on PWR: -3.97,45.36 39.33,45.36 39.33,-2.58 -3.97,-2.58

Small or netless copper shapes (teardrops, artwork), in the pictures only: 1 on Bottom Layer

## Text on the board
Bottom Silkscreen Layer: Author: | myry
